# Altium schematic sheet RoControl.SchDoc
size A2
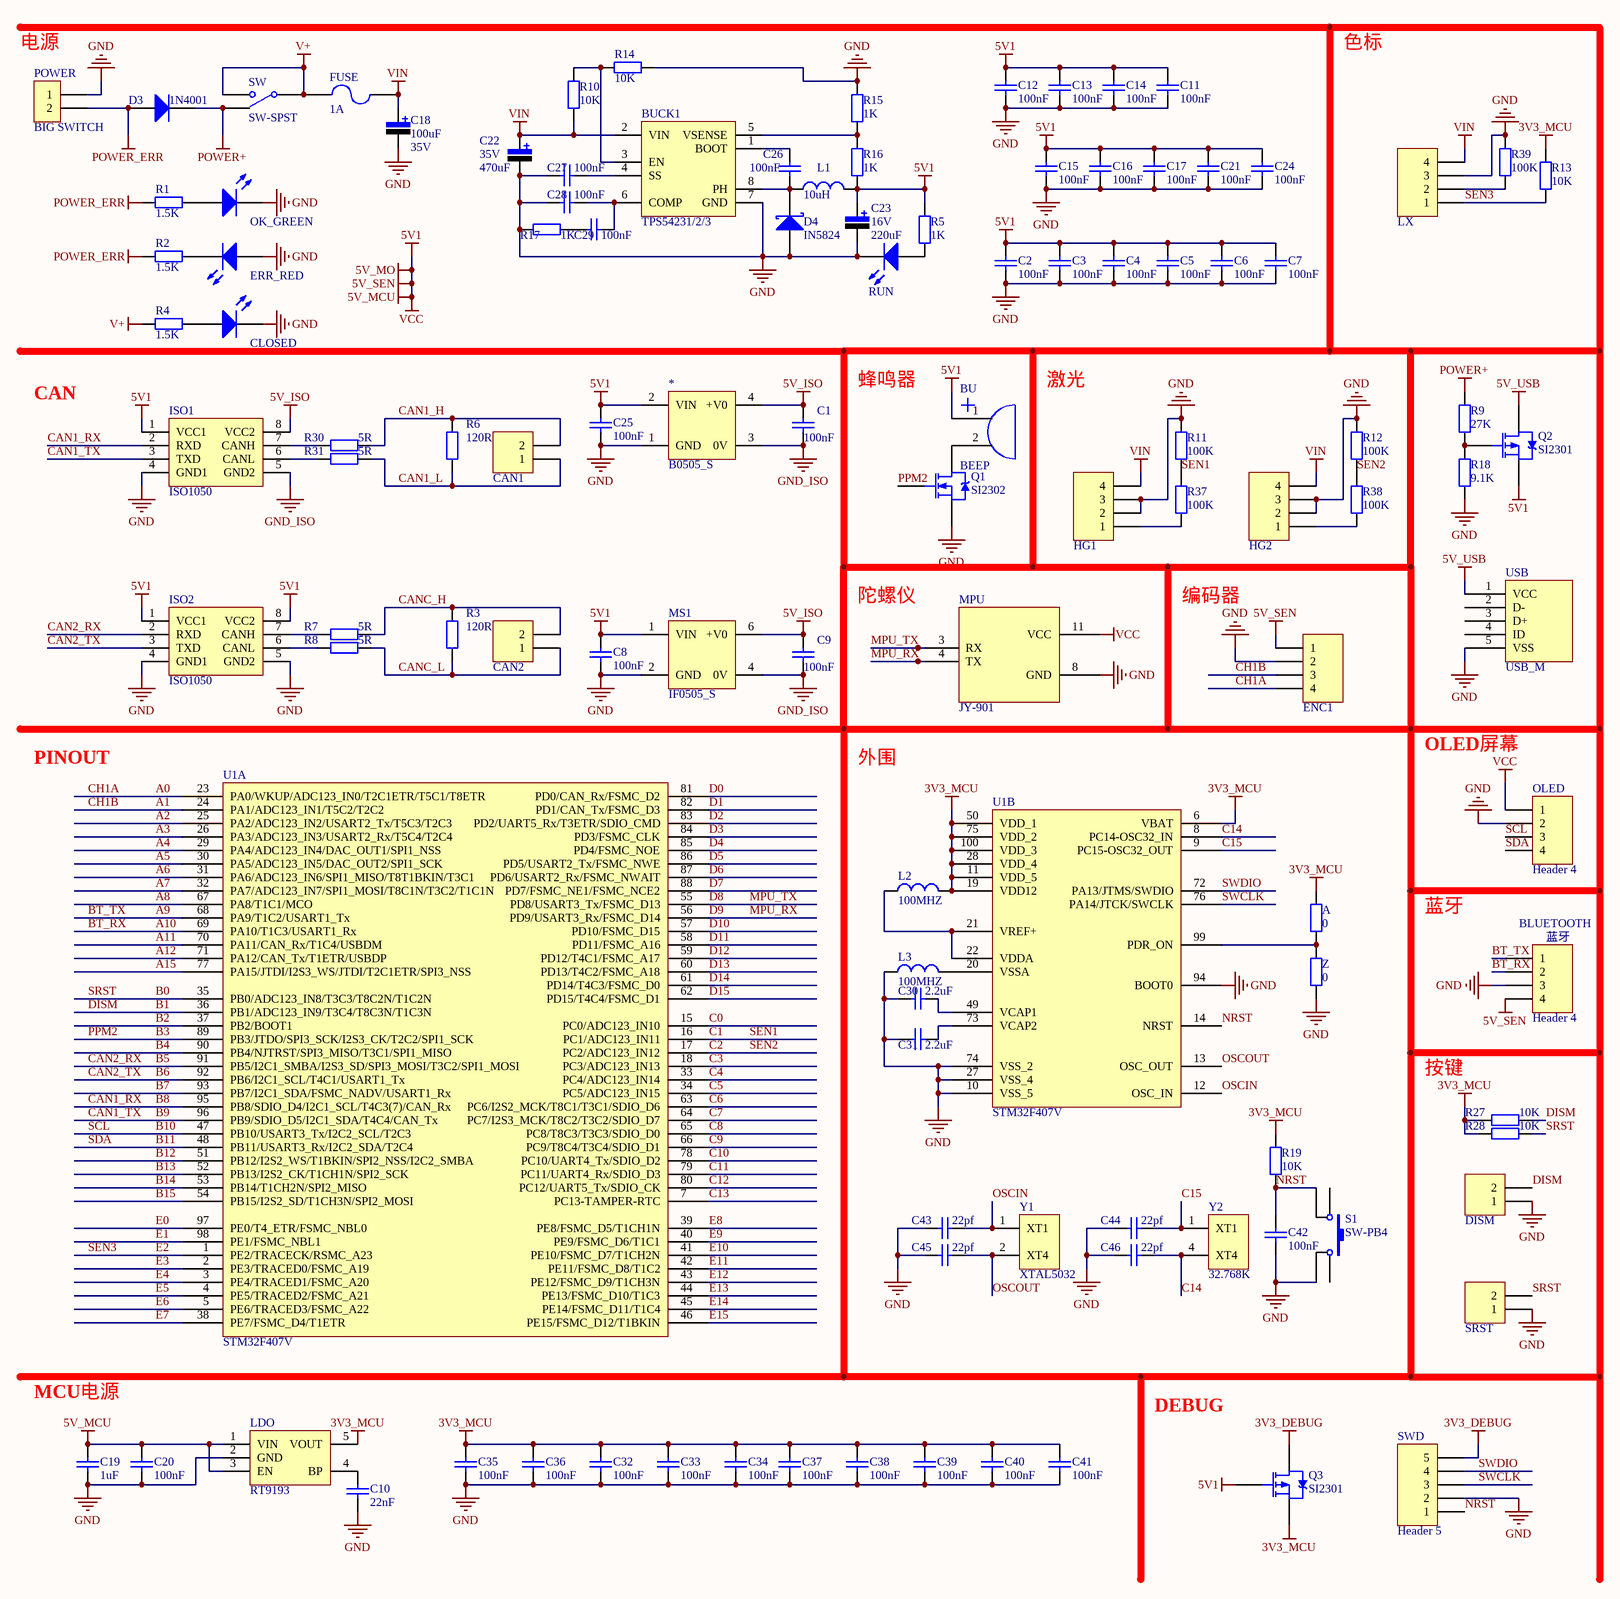
[diagram p0: RoControl.SchDoc]

## Parts
*  B0505_S  [MORNSUN_SIP_S]
A  value 0  [0603-1]  (hidden comment: Res1)
BLUETOOTH  Header 4  [HDR1X4]
BU  BEEP  [BEEP]
BUCK1  TPS54231/2/3  [SOIC8_N]
C1  value 100nF  [CAP-3528]  (hidden comment: Cap)
C2  value 100nF  [CAP-3528]  (hidden comment: Cap)
C3  value 100nF  [CAP-3528]  (hidden comment: Cap)
C4  value 100nF  [C-RAD-0805]  (hidden comment: Cap)
C5  value 100nF  [C-RAD-0805]  (hidden comment: Cap)
C6  value 100nF  [C-RAD-0805]  (hidden comment: Cap)
C7  value 100nF  [C-RAD-0805]  (hidden comment: Cap)
C8  value 100nF  [C-RAD-0805]  (hidden comment: Cap)
C9  value 100nF  [CAP-3528]  (hidden comment: Cap)
C10  value 22nF  [C-RAD-0805]  (hidden comment: Cap)
C11  value 100nF  [CAP-3528]  (hidden comment: Cap)
C12  value 100nF  [CAP-3528]  (hidden comment: Cap)
C13  value 100nF  [CAP-3528]  (hidden comment: Cap)
C14  value 100nF  [CAP-3528]  (hidden comment: Cap)
C15  value 100nF  [CAP-3528]  (hidden comment: Cap)
C16  value 100nF  [CAP-3528]  (hidden comment: Cap)
C17  value 100nF  [CAP-3528]  (hidden comment: Cap)
C18  value 100uF  Vol: 35V  [CAP-3528]  (hidden comment: Cap Pol)
C19  value 1uF  [C-RAD-0805]  (hidden comment: Cap)
C20  value 100nF  [C-RAD-0805]  (hidden comment: Cap)
C21  value 100nF  [CAP-3528]  (hidden comment: Cap)
C22  value 470uF  Vol: 35V  [C-RB-8]  (hidden comment: Cap Pol)
C23  value 220uF  Vol: 16V  [C-RB-8]  (hidden comment: Cap Pol)
C24  value 100nF  [CAP-3528]  (hidden comment: Cap)
C25  value 100nF  [C-RAD-0805]  (hidden comment: Cap)
C26  value 100nF  [C-RAD-0805]  (hidden comment: Cap)
C27  value 100nF  [C-RAD-0805]  (hidden comment: Cap)
C28  value 100nF  [C-RAD-0805]  (hidden comment: Cap)
C29  value 100nF  [C-RAD-0805]  (hidden comment: Cap)
C30  value 2.2uF  [C-RAD-0805]  (hidden comment: Cap)
C31  value 2.2uF  [C-RAD-0805]  (hidden comment: Cap)
C32  value 100nF  [C-RAD-0805]  (hidden comment: Cap)
C33  value 100nF  [C-RAD-0805]  (hidden comment: Cap)
C34  value 100nF  [C-RAD-0805]  (hidden comment: Cap)
C35  value 100nF  [C-RAD-0805]  (hidden comment: Cap)
C36  value 100nF  [C-RAD-0805]  (hidden comment: Cap)
C37  value 100nF  [C-RAD-0805]  (hidden comment: Cap)
C38  value 100nF  [C-RAD-0805]  (hidden comment: Cap)
C39  value 100nF  [C-RAD-0805]  (hidden comment: Cap)
C40  value 100nF  [C-RAD-0805]  (hidden comment: Cap)
C41  value 100nF  [C-RAD-0805]  (hidden comment: Cap)
C42  value 100nF  [C-RAD-0805]  (hidden comment: Cap)
C43  value 22pf  [C-RAD-0603]  (hidden comment: Cap)
C44  value 22pf  [C-RAD-0603]  (hidden comment: Cap)
C45  value 22pf  [C-RAD-0603]  (hidden comment: Cap)
C46  value 22pf  [C-RAD-0603]  (hidden comment: Cap)
CAN1  Header 2  [HDR2X1_C]  (value not drawn)
CAN2  Header 2  [HDR2X1_C]  (value not drawn)
CLOSED  LED0  [LED_0805]  (value not drawn)
D3  Type: 1N4001  [DIODE-SMA]  (hidden comment: Diode)
D4  Type: IN5824  [DIODE-1206]  (hidden comment: D-Schottky)
DISM  Header 2  [HDR2X1_B1]  (value not drawn)
ENC1  Header 4  [HDR4X1_B1]  (value not drawn)
ERR_RED  LED0  [LED_0805]  (value not drawn)
FUSE  value 1A  [1812]  (hidden comment: Fuse)
HG1  Header 4  [HDR4X1_B1]  (value not drawn)
HG2  Header 4  [HDR4X1_B1]  (value not drawn)
ISO1  ISO1050  [SOP254P1040X485-8N]
ISO2  ISO1050  [SOP254P1040X485-8N]
L1  value 10uH  [CD54]  (hidden comment: Inductor)
L2  value 100MHZ  [0805-1]  (hidden comment: Inductor)
L3  value 100MHZ  [0805-1]  (hidden comment: Inductor)
LDO  RT9193  [SOT104P300X129-5N]
LX  Header 4  [HDR4X1_B1]  (value not drawn)
MPU  JY-901  [JY-901 - duplicate]
MS1  IF0505_S  [MORNSUN_SIP_LS]
OK_GREEN  LED0  [LED_0805]  (value not drawn)
OLED  Header 4  [HDR1X4]
POWER  BIG SWITCH  [Header 2]
Q1  SI2302  [SOT-23_L]
Q2  SI2301  [SOT-23_N]
Q3  SI2301  [SOT-23_N]
R1  value 1.5K  [0805-1]  (hidden comment: Res1)
R2  value 1.5K  [0805-1]  (hidden comment: Res1)
R3  value 120R  [1206]  (hidden comment: Res1)
R4  value 1.5K  [0805-1]  (hidden comment: Res1)
R5  value 1K  [0805-1]  (hidden comment: Res1)
R6  value 120R  [1206]  (hidden comment: Res1)
R7  value 5R  [0805-1]  (hidden comment: Res1)
R8  value 5R  [0805-1]  (hidden comment: Res1)
R9  value 27K  [0805-1]  (hidden comment: Res1)
R10  value 10K  [0805-1]  (hidden comment: Res1)
R11  value 100K  [0805-1]  (hidden comment: Res1)
R12  value 100K  [0805-1]  (hidden comment: Res1)
R13  value 10K  [0805-1]  (hidden comment: Res1)
R14  value 10K  [0805-1]  (hidden comment: Res1)
R15  value 1K  [0805-1]  (hidden comment: Res1)
R16  value 1K  [0805-1]  (hidden comment: Res1)
R17  value 1K  [0805-1]  (hidden comment: Res1)
R18  value 9.1K  [0805-1]  (hidden comment: Res1)
R19  value 10K  [0805-1]  (hidden comment: Res1)
R27  value 10K  [0805-1]  (hidden comment: Res1)
R28  value 10K  [0805-1]  (hidden comment: Res1)
R30  value 5R  [0805-1]  (hidden comment: Res1)
R31  value 5R  [0805-1]  (hidden comment: Res1)
R37  value 100K  [0805-1]  (hidden comment: Res1)
R38  value 100K  [0805-1]  (hidden comment: Res1)
R39  value 100K  [0805-1]  (hidden comment: Res1)
RUN  LED0  [LED_0805]  (value not drawn)
S1  SW-PB4  [SW_PB4_A1]
SRST  Header 2  [HDR2X1_B1]  (value not drawn)
SW  SW-SPST  [SW-SPST]
SWD  Header 5  [HDR1X5]
U1  STM32F407V  [LQFP-100_M]  (parts A,B of 2)
USB  USB_M  [USB_MICRO]
Y1  XTAL5032  [XTAL_5032]
Y2  32.768K  [32.768K_SMD]
Z  value 0  [0603-1]  (hidden comment: Res1)

## Nets
3V3_DEBUG: Q3.3(D) SWD.5
3V3_MCU: A.1 C32.2 C33.2 C34.2 C35.2 C36.2 C37.2 C38.2 C39.2 C40.2 C41.2 L2.2 LDO.5(VOUT) Q3.2(S) R13.2 R19.2 R27.1 R28.1 U1.6(VBAT) U1.11(VDD_5) U1.19(VDD12) U1.28(VDD_4) U1.50(VDD_1) U1.75(VDD_2) U1.100(VDD_3)
5V1: *.2(VIN) BLUETOOTH.4 BU.1 C2.2 C3.2 C4.2 C5.2 C6.2 C7.2 C8.2 C11.2 C12.2 C13.2 C14.2 C15.2 C16.2 C17.2 C19.2 C20.2 C21.2 C23.1 C24.2 C25.2 ENC1.1 ISO1.1(VCC1) ISO2.1(VCC1) ISO2.8(VCC2) L1.2 LDO.1(VIN) LDO.3(EN) MPU.11(VCC) MS1.1(VIN) OLED.1 Q2.2(S) Q3.1(G) R5.2 R16.1  [also labelled 5V_MCU, 5V_MO, 5V_SEN, VCC]
5V_ISO: *.4(+V0) C1.1 C9.1 ISO1.8(VCC2) MS1.6(+V0)
5V_USB: Q2.3(D) USB.1(VCC)
GND: *.1(GND) BLUETOOTH.3 BUCK1.7(GND) C2.1 C3.1 C4.1 C5.1 C6.1 C7.1 C8.1 C10.1 C11.1 C12.1 C13.1 C14.1 C15.1 C16.1 C17.1 C18.2 C19.1 C20.1 C21.1 C22.2 C23.2 C24.1 C25.1 C27.1 C28.1 C30.2 C31.2 C32.1 C33.1 C34.1 C35.1 C36.1 C37.1 C38.1 C39.1 C40.1 C41.1 C42.1 C43.1 C44.1 C45.1 C46.1 CLOSED.2(K) D4.1(A) DISM.1 ENC1.2 ERR_RED.1(A) HG1.2 HG1.3 HG2.2 HG2.3 ISO1.4(GND1) ISO2.4(GND1) ISO2.5(GND2) L3.1 LDO.2(GND) LX.3 MPU.8(GND) MS1.2(GND) OK_GREEN.2(K) OLED.2 POWER.1 Q1.2(S) R11.2 R12.2 R14.2 R15.2 R17.1 R18.1 R39.2 RUN.2(K) S1.3 SRST.1 SWD.2 U1.10(VSS_5) U1.27(VSS_4) U1.74(VSS_2) U1.94(BOOT0) USB.5(VSS) Z.2
GND_ISO: *.3(0V) C1.2 C9.2 ISO1.5(GND2) MS1.4(0V)
POWER+: D3.2(K) R9.2 SW.1(NO1)
POWER_ERR: D3.1(A) POWER.2 R1.1 R2.1
V+: FUSE.2 R4.2 SW.2(COMMON) SW.3(NO2)
VIN: BUCK1.2(VIN) C18.1 C22.1 FUSE.1 HG1.4 HG2.4 LX.4 R10.1
A0: ENC1.4 U1.23(PA0/WKUP/ADC123_IN0/T2C1ETR/T5C1/T8ETR)  [also labelled CH1A]
A1: ENC1.3 U1.24(PA1/ADC123_IN1/T5C2/T2C2)  [also labelled CH1B]
A2: U1.25(PA2/ADC123_IN2/USART2_Tx/T5C3/T2C3)
A3: U1.26(PA3/ADC123_IN3/USART2_Rx/T5C4/T2C4)
A4: U1.29(PA4/ADC123_IN4/DAC_OUT1/SPI1_NSS)
A5: U1.30(PA5/ADC123_IN5/DAC_OUT2/SPI1_SCK)
A6: U1.31(PA6/ADC123_IN6/SPI1_MISO/T8T1BKIN/T3C1)
A7: U1.32(PA7/ADC123_IN7/SPI1_MOSI/T8C1N/T3C2/T1C1N)
A8: U1.67(PA8/T1C1/MCO)
A9: BLUETOOTH.1 U1.68(PA9/T1C2/USART1_Tx)  [also labelled BT_TX]
A10: BLUETOOTH.2 U1.69(PA10/T1C3/USART1_Rx)  [also labelled BT_RX]
A11: U1.70(PA11/CAN_Rx/T1C4/USBDM)
A12: U1.71(PA12/CAN_Tx/T1ETR/USBDP)
A15: U1.77(PA15/JTDI/I2S3_WS/JTDI/T2C1ETR/SPI3_NSS)
B0: R28.2 SRST.2 U1.35(PB0/ADC123_IN8/T3C3/T8C2N/T1C2N)  [also labelled SRST]
B1: DISM.2 R27.2 U1.36(PB1/ADC123_IN9/T3C4/T8C3N/T1C3N)  [also labelled DISM]
B2: U1.37(PB2/BOOT1)
B3: Q1.1(G) U1.89(PB3/JTDO/SPI3_SCK/I2S3_CK/T2C2/SPI1_SCK)  [also labelled PPM2]
B4: U1.90(PB4/NJTRST/SPI3_MISO/T3C1/SPI1_MISO)
B5: ISO2.2(RXD) U1.91(PB5/I2C1_SMBA/I2S3_SD/SPI3_MOSI/T3C2/SPI1_MOSI)  [also labelled CAN2_RX]
B6: ISO2.3(TXD) U1.92(PB6/I2C1_SCL/T4C1/USART1_Tx)  [also labelled CAN2_TX]
B7: U1.93(PB7/I2C1_SDA/FSMC_NADV/USART1_Rx)
B8: ISO1.2(RXD) U1.95(PB8/SDIO_D4/I2C1_SCL/T4C3(7)/CAN_Rx)  [also labelled CAN1_RX]
B9: ISO1.3(TXD) U1.96(PB9/SDIO_D5/I2C1_SDA/T4C4/CAN_Tx)  [also labelled CAN1_TX]
B10: OLED.3 U1.47(PB10/USART3_Tx/I2C2_SCL/T2C3)  [also labelled SCL]
B11: OLED.4 U1.48(PB11/USART3_Rx/I2C2_SDA/T2C4)  [also labelled SDA]
B12: U1.51(PB12/I2S2_WS/T1BKIN/SPI2_NSS/I2C2_SMBA)
B13: U1.52(PB13/I2S2_CK/T1CH1N/SPI2_SCK)
B14: U1.53(PB14/T1CH2N/SPI2_MISO)
B15: U1.54(PB15/I2S2_SD/T1CH3N/SPI2_MOSI)
C0: U1.15(PC0/ADC123_IN10)
C1: R11.1 R37.2 U1.16(PC1/ADC123_IN11)  [also labelled SEN1]
C2: R12.1 R38.2 U1.17(PC2/ADC123_IN12)  [also labelled SEN2]
C3: U1.18(PC3/ADC123_IN13)
C4: U1.33(PC4/ADC123_IN14)
C5: U1.34(PC5/ADC123_IN15)
C6: U1.63(PC6/I2S2_MCK/T8C1/T3C1/SDIO_D6)
C7: U1.64(PC7/I2S3_MCK/T8C2/T3C2/SDIO_D7)
C8: U1.65(PC8/T8C3/T3C3/SDIO_D0)
C9: U1.66(PC9/T8C4/T3C4/SDIO_D1)
C10: U1.78(PC10/UART4_Tx/SDIO_D2)
C11: U1.79(PC11/UART4_Rx/SDIO_D3)
C12: U1.80(PC12/UART5_Tx/SDIO_CK)
C13: U1.7(PC13-TAMPER-RTC)
C14: C46.2 U1.8(PC14-OSC32_IN) Y2.4(XT4)
C15: C44.2 U1.9(PC15-OSC32_OUT) Y2.1(XT1)
CAN1_H: CAN1.2 R6.2 R30.1
CAN1_L: CAN1.1 R6.1 R31.1
CANC_H: CAN2.2 R3.2 R7.1
CANC_L: CAN2.1 R3.1 R8.1
D0: U1.81(PD0/CAN_Rx/FSMC_D2)
D1: U1.82(PD1/CAN_Tx/FSMC_D3)
D2: U1.83(PD2/UART5_Rx/T3ETR/SDIO_CMD)
D3: U1.84(PD3/FSMC_CLK)
D4: U1.85(PD4/FSMC_NOE)
D5: U1.86(PD5/USART2_Tx/FSMC_NWE)
D6: U1.87(PD6/USART2_Rx/FSMC_NWAIT)
D7: U1.88(PD7/FSMC_NE1/FSMC_NCE2)
D8: MPU.3(RX) U1.55(PD8/USART3_Tx/FSMC_D13)  [also labelled MPU_TX]
D9: MPU.4(TX) U1.56(PD9/USART3_Rx/FSMC_D14)  [also labelled MPU_RX]
D10: U1.57(PD10/FSMC_D15)
D11: U1.58(PD11/FSMC_A16)
D12: U1.59(PD12/T4C1/FSMC_A17)
D13: U1.60(PD13/T4C2/FSMC_A18)
D14: U1.61(PD14/T4C3/FSMC_D0)
D15: U1.62(PD15/T4C4/FSMC_D1)
E0: U1.97(PE0/T4_ETR/FSMC_NBL0)
E1: U1.98(PE1/FSMC_NBL1)
E2: LX.1 R13.1 U1.1(PE2/TRACECK/RSMC_A23)  [also labelled SEN3]
E3: U1.2(PE3/TRACED0/FSMC_A19)
E4: U1.3(PE4/TRACED1/FSMC_A20)
E5: U1.4(PE5/TRACED2/FSMC_A21)
E6: U1.5(PE6/TRACED3/FSMC_A22)
E7: U1.38(PE7/FSMC_D4/T1ETR)
E8: U1.39(PE8/FSMC_D5/T1CH1N)
E9: U1.40(PE9/FSMC_D6/T1C1)
E10: U1.41(PE10/FSMC_D7/T1CH2N)
E11: U1.42(PE11/FSMC_D8/T1C2)
E12: U1.43(PE12/FSMC_D9/T1CH3N)
E13: U1.44(PE13/FSMC_D10/T1C3)
E14: U1.45(PE14/FSMC_D11/T1C4)
E15: U1.46(PE15/FSMC_D12/T1BKIN)
NRST: C42.2 R19.1 S1.4 SWD.1 U1.14(NRST)
OSCIN: C43.2 U1.12(OSC_IN) Y1.1(XT1)
OSCOUT: C45.2 U1.13(OSC_OUT) Y1.2(XT4)
SWCLK: SWD.3 U1.76(PA14/JTCK/SWCLK)
SWDIO: SWD.4 U1.72(PA13/JTMS/SWDIO)
NetA_2: A.2 U1.99(PDR_ON) Z.1
NetBU_2: BU.2 Q1.3(D)
NetBUCK1_1: BUCK1.1(BOOT) C26.2
NetBUCK1_3: BUCK1.3(EN) R10.2 R14.1
NetBUCK1_4: BUCK1.4(SS) C27.2
NetBUCK1_5: BUCK1.5(VSENSE) R15.1 R16.2
NetBUCK1_6: BUCK1.6(COMP) C28.2 C29.2
NetBUCK1_8: BUCK1.8(PH) C26.1 D4.2(K) L1.1
NetC10_2: C10.2 LDO.4(BP)
NetC29_1: C29.1 R17.2
NetC30_1: C30.1 U1.49(VCAP1)
NetC31_1: C31.1 U1.73(VCAP2)
NetCLOSED_1: CLOSED.1(A) R4.1
NetERR_RED_2: ERR_RED.2(K) R2.2
NetHG1_1: HG1.1 R37.1
NetHG2_1: HG2.1 R38.1
NetISO1_6: ISO1.6(CANL) R31.2
NetISO1_7: ISO1.7(CANH) R30.2
NetISO2_6: ISO2.6(CANL) R8.2
NetISO2_7: ISO2.7(CANH) R7.2
NetL2_1: L2.1 U1.21(VREF+) U1.22(VDDA)
NetL3_2: L3.2 U1.20(VSSA)
NetLX_2: LX.2 R39.1
NetOK_GREEN_1: OK_GREEN.1(A) R1.2
NetQ2_1: Q2.1(G) R9.1 R18.2
NetR5_1: R5.1 RUN.1(A)

Not connected (* = marked no-connect by the designer): S1 1 2; USB 2(D-) 3(D+) 4(ID)

## Notes on the sheet
- (near POWER) 电源
- 色标
- CAN
- 蜂鸣器
- 激光
- 陀螺仪
- 编码器
- PINOUT
- 外围
- OLED屏幕
- 蓝牙
- (near BLUETOOTH) 蓝牙
- 按键
- MCU电源
- DEBUG

## Library data of the parts
A R1-R19 R27 R28 R30 R31 R37-R39 Z = Res1: 贴片电阻; Published: 8-Jun-2000; LatestRevisionDate: 17-Jul-2002; LatestRevisionNote: Re-released for DXP Platform.; PackageReference: AXIAL-0.4; Publisher: Altium Limited
BLUETOOTH OLED = Header 4: Header, 4-Pin; LatestRevisionDate: 17-Jul-2002; LatestRevisionNote: Re-released for DXP Platform.; Publisher: Altium Limited
BU = BEEP: 蜂鸣器
C1-C17 C19-C21 C24-C46 = Cap: 无极性电容; Published: 8-Jun-2000; LatestRevisionDate: 17-Jul-2002; LatestRevisionNote: Re-released for DXP Platform.; PackageReference: RAD-0.3; Publisher: Altium Limited
C18 C22 C23 = Cap Pol: 极性电解电容; Published: 8-Jun-2000; LatestRevisionDate: 17-Jul-2002; LatestRevisionNote: Re-released for DXP Platform.; PackageReference: RB7.6-15; Publisher: Altium Limited
CAN1 CAN2 DISM SRST = Header 2: 接插件; LatestRevisionDate: 17-Jul-2002; LatestRevisionNote: Re-released for DXP Platform.; Publisher: Altium Limited
CLOSED ERR_RED OK_GREEN RUN = LED0: 发光二极管; Published: 8-Jun-2000; LatestRevisionDate: 08-Jul-2005; LatestRevisionNote: Mech Layer 1 removed.; PackageReference: LED-0; Publisher: Altium Limited
D3 = Diode: 二极管; Published: 8-Jun-2000; LatestRevisionDate: 17-Jul-2002; LatestRevisionNote: Re-released for DXP Platform.; PackageDocument: Sep-1996; PackageReference: SMC; Publisher: Altium Limited; Code_JEDEC: DO-214-AB
D4 = D-Schottky: 肖特基二极管; Published: 8-Jun-2000; LatestRevisionDate: 17-Jul-2002; LatestRevisionNote: Re-released for DXP Platform.; PackageReference: SMB; Publisher: Altium Limited; Code_JEDEC: DO-214-AA
ENC1 HG1 HG2 LX = Header 4: 接插件; LatestRevisionDate: 17-Jul-2002; LatestRevisionNote: Re-released for DXP Platform.; Publisher: Altium Limited
FUSE = Fuse 2: 保险丝; Published: 8-Jun-2000; LatestRevisionDate: 17-Jul-2002; LatestRevisionNote: Re-released for DXP Platform.; PackageReference: PIN-W2/E2.8; Publisher: Altium Limited
L1-L3 = Inductor: 电感; Code_IEC: 1005; Published: 8-Jun-2000; LatestRevisionDate: 17-Jul-2002; LatestRevisionNote: Re-released for DXP Platform.; PackageReference: 0402-A; Publisher: Altium Limited; Code_JEITA: 0402
MPU = JY-901: 君悦智控高精度9轴传感器
POWER = Header 2 BIG: Header, 2-Pin; LatestRevisionDate: 17-Jul-2002; LatestRevisionNote: Re-released for DXP Platform.; Publisher: Altium Limited
Q1 = IRLML2402: HEXFET Power MOSFET; Published: 8-Jun-2000; LatestRevisionDate: 20-Nov-2009; LatestRevisionNote: IPC-7351 Footprint Added.; DatasheetVersion: Aug-1997; PackageReference: SOT-23; Publisher: Altium Limited; PackageDescription: 3-Pin SOT-23 Package 0.95 mm Pitch, 2.3 mm Lead Span; ComponentLink1Description: Manufacturer Link; ComponentLink1URL: http://www.irf.com/; ComponentLink2Description: Datasheet; ComponentLink2URL: http://www.irf.com/product-info/datasheets/data/irlml2402.pdf
Q2 Q3 = IRLML5103: HEXFET Power MOSFET; Published: 8-Jun-2000; LatestRevisionDate: 20-Nov-2009; LatestRevisionNote: IPC-7351 Footprint Added.; DatasheetVersion: Aug-1997; PackageReference: SOT-23; Publisher: Altium Limited; PackageDescription: 3-Pin SOT-23 Package 0.95 mm Pitch, 2.3 mm Lead Span; ComponentLink1Description: Manufacturer Link; ComponentLink1URL: http://www.irf.com/; ComponentLink2Description: Datasheet; ComponentLink2URL: http://www.irf.com/product-info/datasheets/data/irlml5103.pdf
S1 = SW-PB4: 微动开关; Published: 24-Mar-1999; LatestRevisionDate: 17-Jul-2002; LatestRevisionNote: Re-released for DXP Platform.; PackageReference: SPST-2; Publisher: Altium Limited
SW = SW-SPST: Single-Pole, Single-Throw Switch; Published: 24-Mar-1999; LatestRevisionDate: 17-Jul-2002; LatestRevisionNote: Re-released for DXP Platform.; PackageReference: SPST-2; Publisher: Altium Limited; PackageDescription: Switch; 2 Leads
SWD = Header 5: Header, 5-Pin; LatestRevisionDate: 17-Jul-2002; LatestRevisionNote: Re-released for DXP Platform.; Publisher: Altium Limited
U1 = STM32F407V: STM32单片机100引脚
USB = USB_M: MicroUSB接口